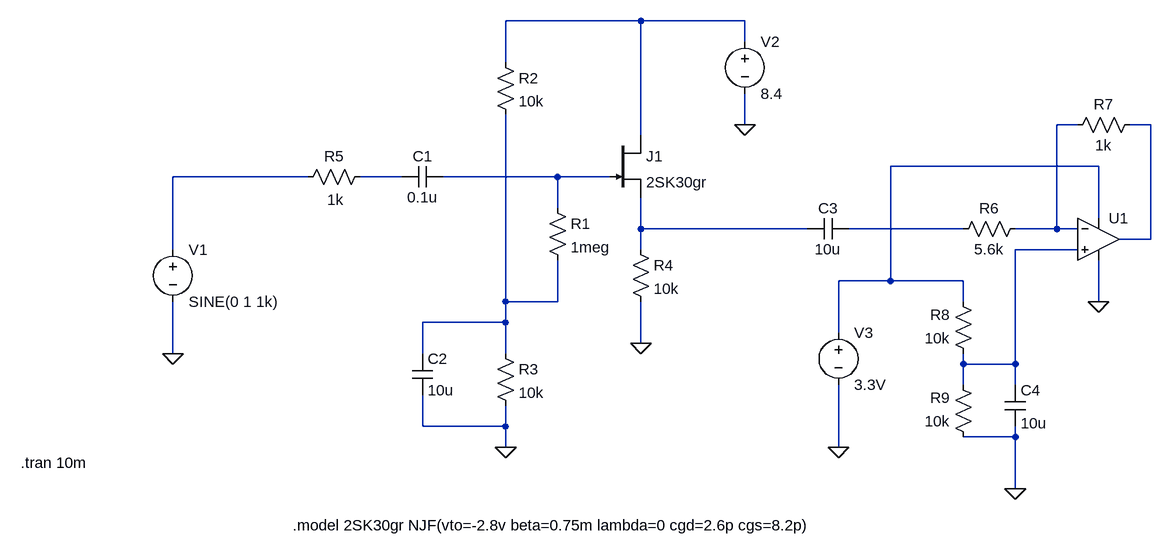
[diagram p0: schematic bg659Input.asc]
bg659Input.asc, the LTspice schematic file:
Version 4
SHEET 1 1192 728
WIRE 208 -64 0 -64
WIRE 368 -64 208 -64
WIRE 368 -32 368 -64
WIRE 0 0 0 -64
WIRE 368 96 368 48
WIRE 880 96 848 96
WIRE 992 96 960 96
WIRE 208 112 208 -64
WIRE 912 160 592 160
WIRE -304 176 -512 176
WIRE -160 176 -224 176
WIRE 80 176 -96 176
WIRE 160 176 80 176
WIRE 80 224 80 176
WIRE 912 240 912 160
WIRE 208 256 208 208
WIRE 464 256 208 256
WIRE 704 256 528 256
WIRE 848 256 848 96
WIRE 848 256 784 256
WIRE 880 256 848 256
WIRE 992 272 992 96
WIRE 992 272 944 272
WIRE -512 288 -512 176
WIRE 208 288 208 256
WIRE 880 288 784 288
WIRE 592 336 592 160
WIRE 592 336 512 336
WIRE 704 336 592 336
WIRE 0 368 0 80
WIRE 80 368 80 304
WIRE 80 368 0 368
WIRE 704 368 704 336
WIRE 912 368 912 304
WIRE 0 400 0 368
WIRE 0 400 -128 400
WIRE 512 416 512 336
WIRE 208 432 208 368
WIRE -512 448 -512 368
WIRE -128 448 -128 400
WIRE 0 448 0 400
WIRE 704 464 704 448
WIRE 784 464 784 288
WIRE 784 464 704 464
WIRE 704 496 704 464
WIRE 784 496 784 464
WIRE -128 560 -128 512
WIRE 0 560 0 528
WIRE 0 560 -128 560
WIRE 784 576 784 560
WIRE 784 576 704 576
WIRE 0 592 0 560
WIRE 512 592 512 496
WIRE 784 656 784 576
FLAG 208 432 0
FLAG 0 592 0
FLAG -512 448 0
FLAG 368 96 0
FLAG 784 656 0
FLAG 512 592 0
FLAG 912 368 0
SYMBOL njf 160 112 R0
SYMATTR InstName J1
SYMATTR Value 2SK30gr
SYMBOL res 64 208 R0
SYMATTR InstName R1
SYMATTR Value 1meg
SYMBOL res -16 -16 R0
SYMATTR InstName R2
SYMATTR Value 10k
SYMBOL res -16 432 R0
SYMATTR InstName R3
SYMATTR Value 10k
SYMBOL res 192 272 R0
SYMATTR InstName R4
SYMATTR Value 10k
SYMBOL res -208 160 R90
WINDOW 0 0 56 VBottom 2
WINDOW 3 36 54 VTop 2
SYMATTR InstName R5
SYMATTR Value 1k
SYMBOL voltage -512 272 R0
WINDOW 123 0 0 Left 2
WINDOW 39 0 0 Left 2
SYMATTR InstName V1
SYMATTR Value SINE(0 1 1k)
SYMBOL voltage 368 -48 R0
WINDOW 123 0 0 Left 2
WINDOW 39 0 0 Left 2
SYMATTR InstName V2
SYMATTR Value 8.4
SYMBOL cap -96 160 R90
WINDOW 0 0 32 VBottom 2
WINDOW 3 32 32 VTop 2
SYMATTR InstName C1
SYMATTR Value 0.1u
SYMBOL cap -144 448 R0
SYMATTR InstName C2
SYMATTR Value 10u
SYMBOL Opamps\\UniversalOpamp2 912 272 R0
SYMATTR InstName U1
SYMBOL cap 528 240 R90
WINDOW 0 0 32 VBottom 2
WINDOW 3 32 32 VTop 2
SYMATTR InstName C3
SYMATTR Value 10u
SYMBOL res 800 240 R90
WINDOW 0 0 56 VBottom 2
WINDOW 3 32 56 VTop 2
SYMATTR InstName R6
SYMATTR Value 5.6k
SYMBOL res 976 80 R90
WINDOW 0 0 56 VBottom 2
WINDOW 3 32 56 VTop 2
SYMATTR InstName R7
SYMATTR Value 1k
SYMBOL res 720 464 R180
WINDOW 0 36 76 Left 2
WINDOW 3 36 40 Left 2
SYMATTR InstName R8
SYMATTR Value 10k
SYMBOL res 720 592 R180
WINDOW 0 36 76 Left 2
WINDOW 3 36 40 Left 2
SYMATTR InstName R9
SYMATTR Value 10k
SYMBOL cap 768 496 R0
WINDOW 3 24 59 Left 2
SYMATTR InstName C4
SYMATTR Value 10u
SYMBOL voltage 512 400 R0
WINDOW 123 0 0 Left 2
WINDOW 39 0 0 Left 2
SYMATTR InstName V3
SYMATTR Value 3.3V
TEXT -328 712 Left 2 !.model 2SK30gr NJF(vto=-2.8v beta=0.75m lambda=0 cgd=2.6p cgs=8.2p)
TEXT -746 616 Left 2 !.tran 10m

The netlist it stands for:
* bg659Input.asc
J1 N001 N007 N008 2SK30gr
R1 N007 N011 1meg
R2 N001 N011 10k
R3 N011 0 10k
R4 N008 0 10k
R5 N006 N005 1k
V1 N005 0 SINE(0 1 1k)
V2 N001 0 8.4
C1 N007 N006 0.1u
C2 N011 0 10u
XU1 N010 N002 N004 0 N003 level.2 Avol=1Meg GBW=10Meg Slew=10Meg ilimit=25m rail=0 Vos=0 phimargin=45 en=0 enk=0 in=0 ink=0 Rin=500Meg  ; pins IN+ IN- V+ V- OUT
C3 N009 N008 10u
R6 N002 N009 5.6k
R7 N003 N002 1k
R8 N010 N004 10k
R9 0 N010 10k
C4 N010 0 10u
V3 N004 0 3.3V
.model NJF NJF
.model PJF PJF
.lib standard.jft
.model 2SK30gr NJF(vto=-2.8v beta=0.75m lambda=0 cgd=2.6p cgs=8.2p)
.tran 10m
.lib UniversalOpamps2.sub
.backanno
.end